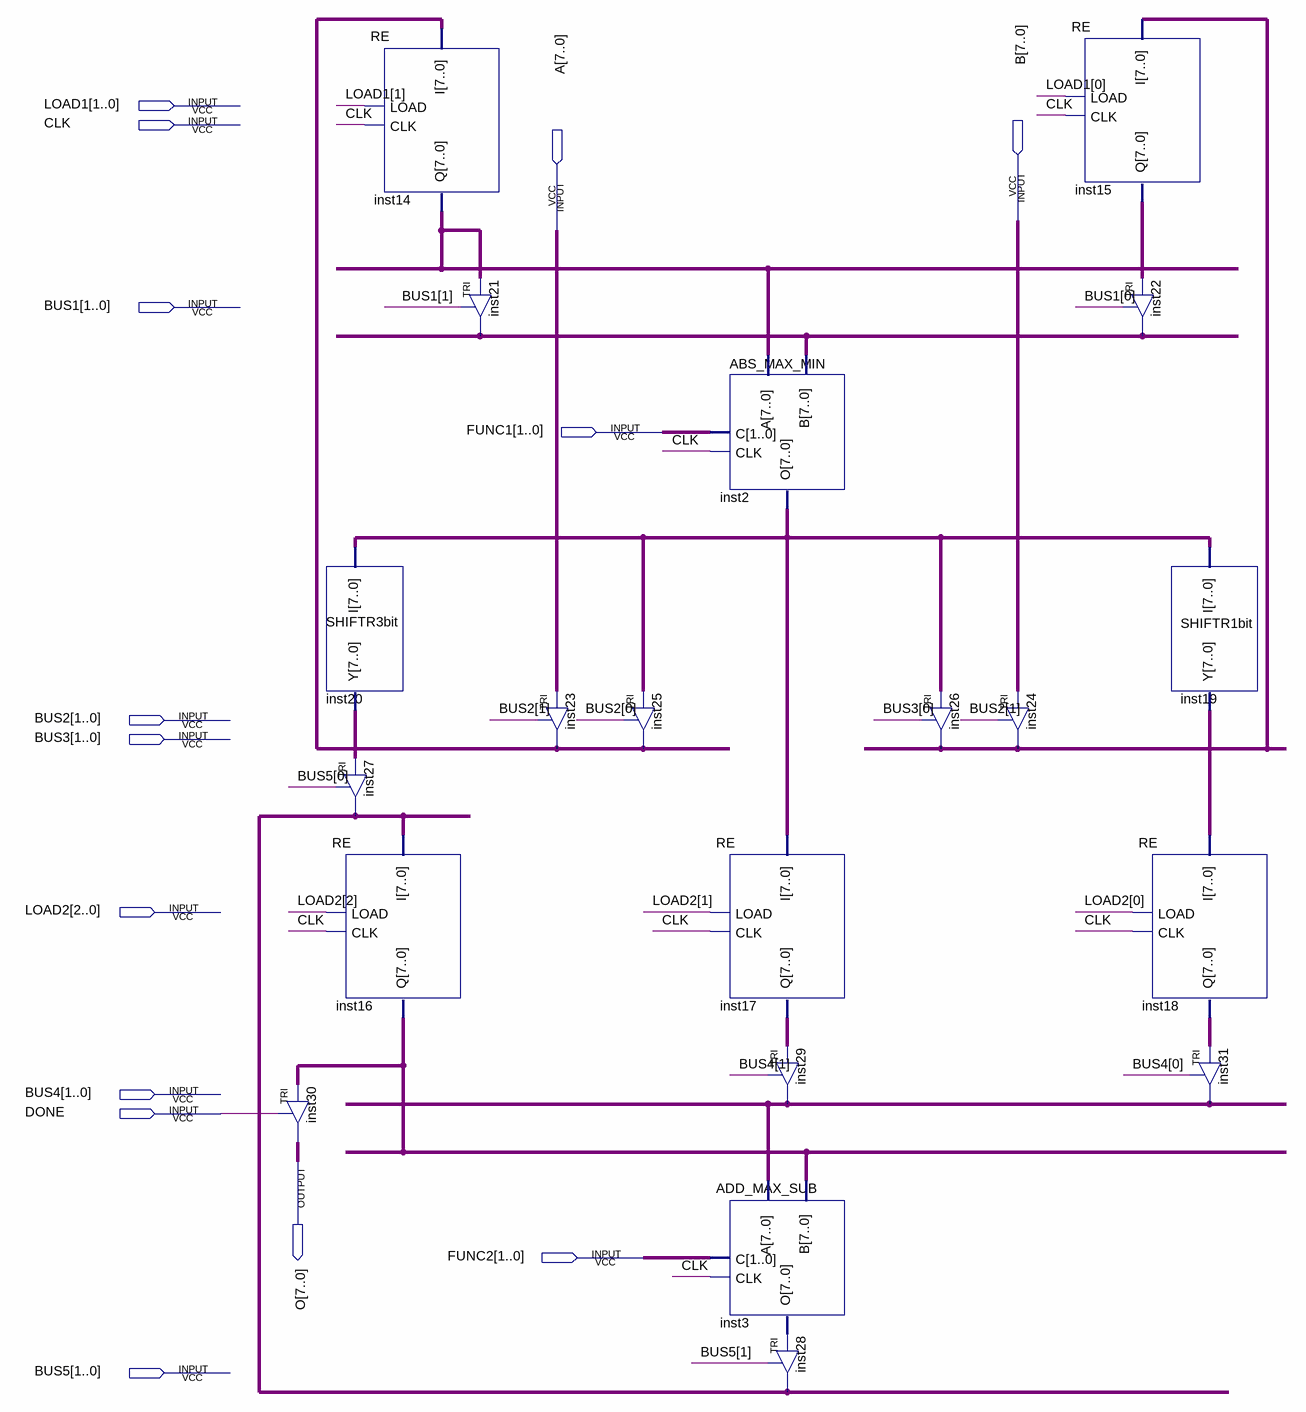
[diagram p0: schematic sheet]
// Quartus schematic datapath.bdf as structural Verilog: 20 symbols, 14 pins
module datapath (
  input  [1:0] LOAD1,
  input  CLK,
  input  [7:0] B,
  input  [7:0] A,
  input  [1:0] BUS1,
  input  [1:0] FUNC1,
  input  [1:0] BUS2,
  input  [1:0] BUS3,
  input  [2:0] LOAD2,
  input  [1:0] BUS4,
  input  DONE,
  input  [1:0] FUNC2,
  input  [1:0] BUS5,
  output [7:0] O
);

  wire [7:0] inst2_o, inst3_o, inst14_q, inst15_q, inst16_q, inst17_q, inst18_q, inst19_y, inst20_y,
       inst21_out, inst23_out, inst26_out, inst27_out, inst29_out;

  TRI inst30[7:0] (.IN(inst16_q), .OE(DONE), .OUT(O));
  RE inst14 (.I(inst23_out), .LOAD(LOAD1[1]), .CLK(CLK), .Q(inst14_q));
  SHIFTR3bit inst20 (.I(inst2_o), .Y(inst20_y));
  TRI inst27[7:0] (.IN(inst20_y), .OE(BUS5[0]), .OUT(inst27_out));
  RE inst16 (.I(inst27_out), .LOAD(LOAD2[2]), .CLK(CLK), .Q(inst16_q));
  TRI inst21[7:0] (.IN(inst14_q), .OE(BUS1[1]), .OUT(inst21_out));
  TRI inst23[7:0] (.IN(A), .OE(BUS2[1]), .OUT(inst23_out));
  TRI inst25[7:0] (.IN(inst2_o), .OE(BUS2[0]), .OUT(inst23_out));
  ABS_MAX_MIN inst2 (.A(inst14_q), .B(inst21_out), .C(FUNC1), .CLK(CLK), .O(inst2_o));
  RE inst17 (.I(inst2_o), .LOAD(LOAD2[1]), .CLK(CLK), .Q(inst17_q));
  ADD_MAX_SUB inst3 (.A(inst29_out), .B(inst16_q), .C(FUNC2), .CLK(CLK), .O(inst3_o));
  TRI inst29[7:0] (.IN(inst17_q), .OE(BUS4[1]), .OUT(inst29_out));
  TRI inst28[7:0] (.IN(inst3_o), .OE(BUS5[1]), .OUT(inst27_out));
  TRI inst26[7:0] (.IN(inst2_o), .OE(BUS3[0]), .OUT(inst26_out));
  RE inst15 (.I(inst26_out), .LOAD(LOAD1[0]), .CLK(CLK), .Q(inst15_q));
  TRI inst24[7:0] (.IN(B), .OE(BUS2[1]), .OUT(inst26_out));
  TRI inst22[7:0] (.IN(inst15_q), .OE(BUS1[0]), .OUT(inst21_out));
  RE inst18 (.I(inst19_y), .LOAD(LOAD2[0]), .CLK(CLK), .Q(inst18_q));
  SHIFTR1bit inst19 (.I(inst2_o), .Y(inst19_y));
  TRI inst31[7:0] (.IN(inst18_q), .OE(BUS4[0]), .OUT(inst29_out));
endmodule
